# Altium schematic sheet Main.SchDoc
size A
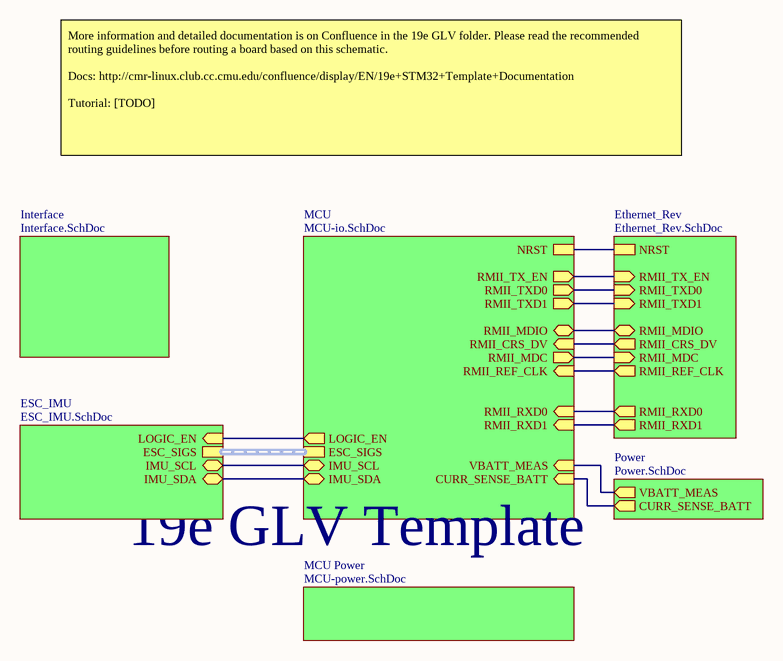
[diagram p0: Main.SchDoc]

## Sub-sheets
ESC_IMU = ESC_IMU.SchDoc: IMU_SCL (bidir), LOGIC_EN (in), IMU_SDA (bidir), ESC_SIGS (harness ESC_SIG)
Ethernet_Rev = Ethernet_Rev.SchDoc: RMII_RXD1 (out), RMII_TXD1 (in), RMII_MDC (in), RMII_CRS_DV (out), RMII_RXD0 (out), RMII_REF_CLK (out), RMII_MDIO (bidir), RMII_TXD0 (in), RMII_TX_EN (in), NRST
Interface = Interface.SchDoc: no entries
MCU = MCU-io.SchDoc: CURR_SENSE_BATT (in), VBATT_MEAS (in), NRST, RMII_TXD1 (out), LOGIC_EN (out), ESC_SIGS (harness ESC_SIG), RMII_MDIO (bidir), RMII_CRS_DV (in), RMII_RXD0 (in), RMII_MDC (out), IMU_SDA (bidir), RMII_TX_EN (out), RMII_TXD0 (out), RMII_REF_CLK (in), IMU_SCL (bidir), RMII_RXD1 (in)
MCU Power = MCU-power.SchDoc: no entries
Power = Power.SchDoc: CURR_SENSE_BATT (out), VBATT_MEAS (out)

## Nets
(unnamed): sheet MCU/CURR_SENSE_BATT, sheet Power/CURR_SENSE_BATT
(unnamed): sheet MCU/VBATT_MEAS, sheet Power/VBATT_MEAS
(unnamed): sheet MCU/NRST, sheet Ethernet_Rev/NRST
(unnamed): sheet MCU/RMII_TXD1, sheet Ethernet_Rev/RMII_TXD1
(unnamed): sheet MCU/LOGIC_EN, sheet ESC_IMU/LOGIC_EN
(unnamed): sheet MCU/RMII_MDIO, sheet Ethernet_Rev/RMII_MDIO
(unnamed): sheet MCU/RMII_CRS_DV, sheet Ethernet_Rev/RMII_CRS_DV
(unnamed): sheet MCU/RMII_RXD0, sheet Ethernet_Rev/RMII_RXD0
(unnamed): sheet MCU/RMII_MDC, sheet Ethernet_Rev/RMII_MDC
(unnamed): sheet MCU/IMU_SDA, sheet ESC_IMU/IMU_SDA
(unnamed): sheet MCU/RMII_TX_EN, sheet Ethernet_Rev/RMII_TX_EN
(unnamed): sheet MCU/RMII_TXD0, sheet Ethernet_Rev/RMII_TXD0
(unnamed): sheet MCU/RMII_REF_CLK, sheet Ethernet_Rev/RMII_REF_CLK
(unnamed): sheet MCU/IMU_SCL, sheet ESC_IMU/IMU_SCL
(unnamed): sheet MCU/RMII_RXD1, sheet Ethernet_Rev/RMII_RXD1

## Buses and harness runs
harness sheet ESC_IMU/ESC_SIGS = sheet MCU/ESC_SIGS

## Notes on the sheet
- More information and detailed documentation is on Confluence in the 19e GLV folder. Please read the recommended routing guidelines before routing a board based on this schematic.
  Docs: http://cmr-linux.club.cc.cmu.edu/confluence/display/EN/19e+STM32+Template+Documentation
  Tutorial: [TODO]
- 19e GLV Template